# Altium schematic sheet BOC_PWR.SchDoc: Board-On-Chip Power Supply
size A; Organization: Altium Limited; Address1: L3, 12a Rodborough Rd; Address2: Frenchs Forest; Address3: NSW; Address4: Australia 2086; Revision: 1.06; SheetNumber: 16; SheetTotal: 16
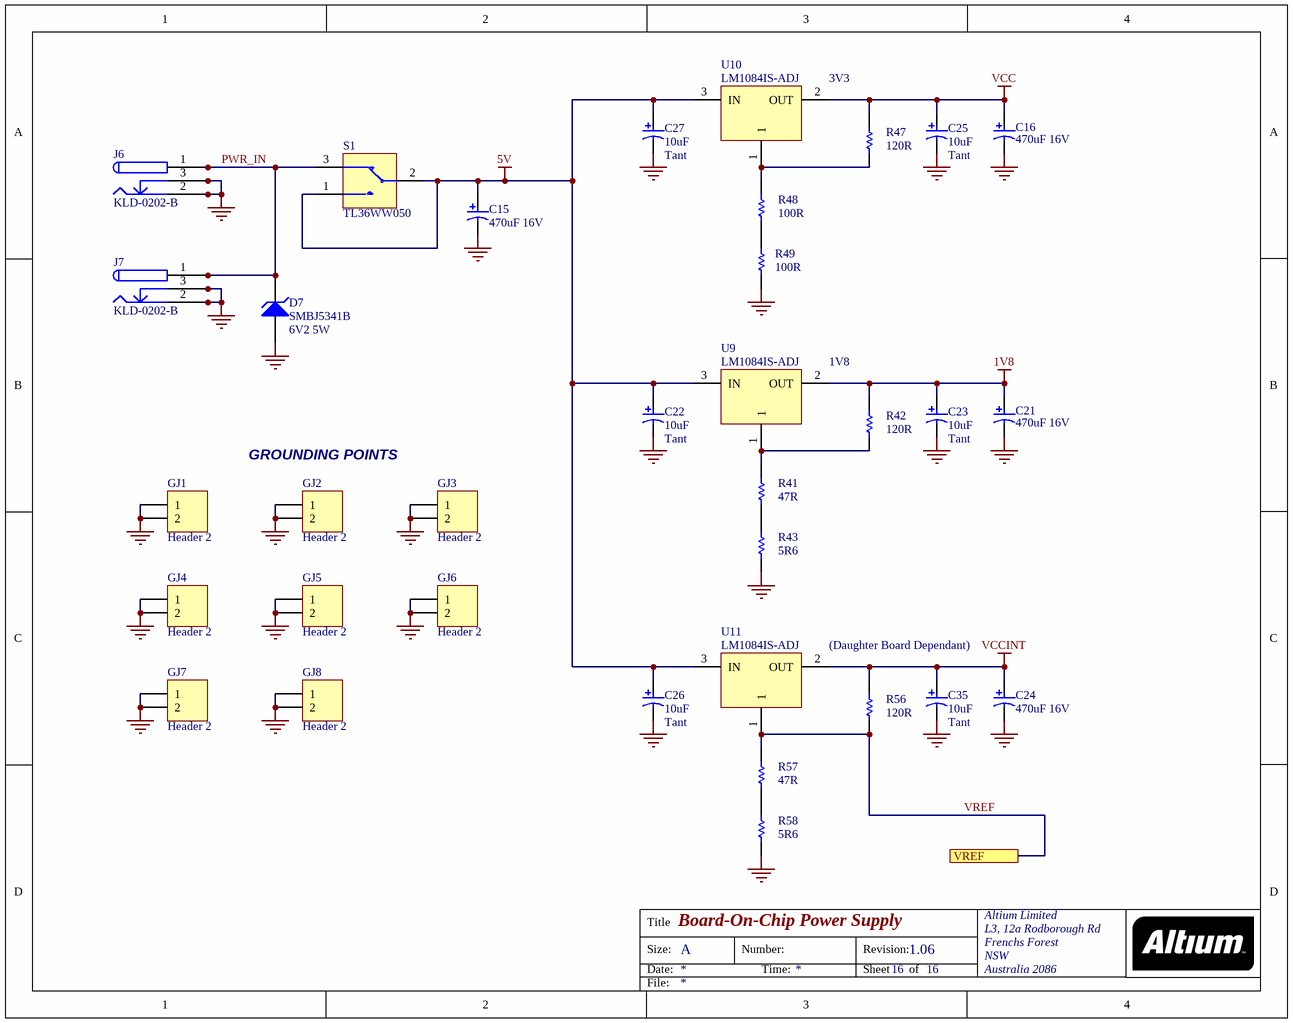
[diagram p0: BOC_PWR.SchDoc]

## Parts
C15  470uF 16V  [RB8/3.5]
C16  470uF 16V  [RB8/3.5]
C21  470uF 16V  [RB8/3.5]
C22  10uF  Capacitor Type: Tant  [MCCT-B]
C23  10uF  Capacitor Type: Tant  [MCCT-B]
C24  470uF 16V  [RB8/3.5]
C25  10uF  Capacitor Type: Tant  [MCCT-B]
C26  10uF  Capacitor Type: Tant  [MCCT-B]
C27  10uF  Capacitor Type: Tant  [MCCT-B]
C35  10uF  Capacitor Type: Tant  [MCCT-B]
D7  SMBJ5341B  Part Description: 6V2 5W  [DO214]
GJ1  Header 2  [HDR1X2]
GJ2  Header 2  [HDR1X2]
GJ3  Header 2  [HDR1X2]
GJ4  Header 2  [HDR1X2]
GJ5  Header 2  [HDR1X2]
GJ6  Header 2  [HDR1X2]
GJ7  Header 2  [HDR1X2]
GJ8  Header 2  [HDR1X2]
J6  KLD-0202-B  [KLD-0202]
J7  KLD-0202-B  [KLD-0202]
R41  47R  [CC2012-0805]
R42  120R  [CC2012-0805]
R43  5R6  [CC2012-0805]
R47  120R  [CC2012-0805]
R48  100R  [CC2012-0805]
R49  100R  [CC2012-0805]
R56  120R  [CC2012-0805]
R57  47R  [CC2012-0805]
R58  5R6  [CC2012-0805]
S1  TL36WW050  [TL36WW15050]
U9  LM1084IS-ADJ  [TO-263]
U10  LM1084IS-ADJ  [TO-263]
U11  LM1084IS-ADJ  [TO-263]

## Ports
VREF

## Nets
1V8: C21.1 C23.1 R42.1 U9.2(OUT)
5V: C15.1 C22.1 C26.1 C27.1 S1.1 S1.2 U9.3(IN) U10.3(IN) U11.3(IN)
GND: C15.2 C16.2 C21.2 C22.2 C23.2 C24.2 C25.2 C26.2 C27.2 C35.2 D7.1(A) GJ1.1 GJ1.2 GJ2.1 GJ2.2 GJ3.1 GJ3.2 GJ4.1 GJ4.2 GJ5.1 GJ5.2 GJ6.1 GJ6.2 GJ7.1 GJ7.2 GJ8.1 GJ8.2 J6.2 J6.2A J6.2B J6.3 J6.3A J6.3B J7.2 J7.2A J7.2B J7.3 J7.3A J7.3B R43.2 R49.1 R58.2
VCC: C16.1 C25.1 R47.1 U10.2(OUT)
VCCINT: C24.1 C35.1 R56.1 U11.2(OUT)
PWR_IN: D7.2(K) J6.1 J6.1A J6.1B J7.1 J7.1A J7.1B S1.3
VREF: R56.2 R57.1 U11.1 ; port VREF
NetR41_1: R41.1 R42.2 U9.1
NetR41_2: R41.2 R43.1
NetR47_2: R47.2 R48.1 U10.1
NetR48_2: R48.2 R49.2
NetR57_2: R57.2 R58.1

## Notes on the sheet
- 3V3
- 1V8
- (near GJ2) GROUNDING POINTS
- (Daughter Board Dependant)
- Title
- Size:
- Date:
- A
- Number:
- Time:
- Revision:
- Sheet
- of
- File:

## Library data of the parts
C15 C16 C21-C27 C35 = CAP_POLAR: Polar Capacitor; Fitted: True
D7 = BZG03C13: Zener Diode, 6.2V, 5W; Manufacturer: Microsemi; Fitted: True; Revision: 31-Oct-2003
GJ1-GJ8 = Header 2: Header, 2-Pin; Manufacturer: Generic Components; Class I: Connector; Fitted: True; Revision: July-2002: Re-released for DXP Platform.; Publisher: Altium Limited
J6 J7 = KLD-0202-B: Low Voltage Power Supply Connector; Manufacturer: Kycon; Fitted: True
R41-R43 R47-R49 R56-R58 = RES: Resistor; Fitted: True
S1 = PCB_MOUNT_SWITCH: SPDT Subminiature Toggle Switch; Fitted: True
U9-U11 = LM1084IS-ADJ: 5A Low Dropout Possitive Regulators; Fitted: True